# Altium project SL1 Xilinx Spartan-IIE PQ208 Rev1.01.PrjPcb
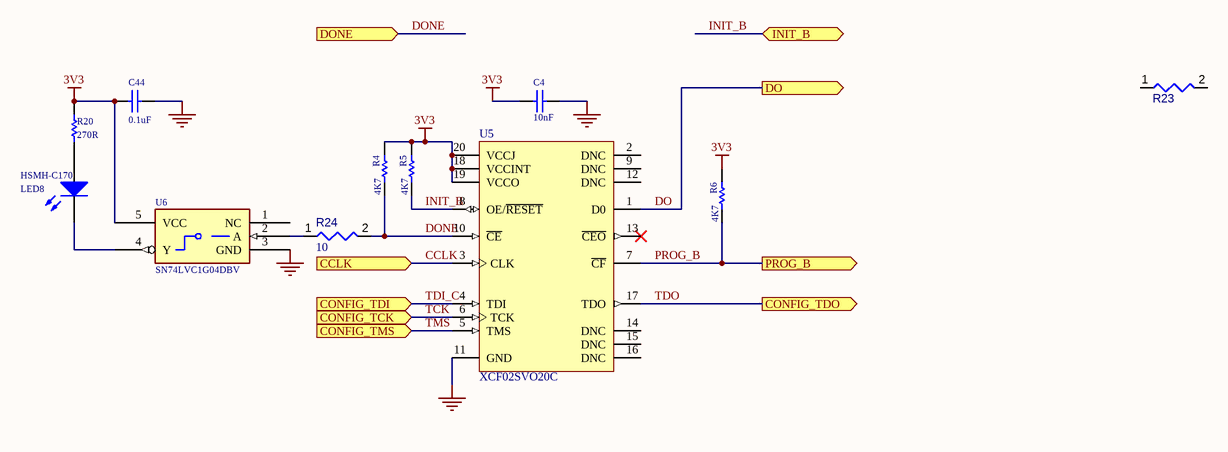
[diagram p0: SL_Config_2E.SchDoc]
2 sheets, 70 parts. Net scope: flat (ports and power ports of the same name join across sheets).
Board file: SL1 Xilinx Spartan-IIE PQ208 Rev1.01.PcbDoc
Sheets:
  SL_Config_2E.SchDoc
  SL_Power.SchDoc

## Sheet SL_Config_2E.SchDoc: FPGA Configuration
size A; Organization: Altium Limited; Address1: L3, 12a Rodborough Rd; Address2: Frenchs Forest; Address3: NSW; Address4: Australia 2086; DocumentNumber: 2; SheetNumber: 2; SheetTotal: 5; Library Name: SpiritLevel_2E.SchLib

### Parts
C4  10nF  [CC1608-0603]
C44  0.1uF  [CC2012-0805]
LED8  HSMH-C170  [SMD _LED]
R4  4K7  [CR2012-0805]
R5  4K7  [CR2012-0805]
R6  4K7  [CR2012-0805]
R20  270R  [CR2012-0805]
R23  Resistors  (value not drawn)
R24  value 10  [RESC1005X40X25ML10T10]  (hidden comment: Resistor 10R +/-5% 0402 63 mW)
U5  XCF02SVO20C  [VO20]
U6  SN74LVC1G04DBV  [SO-G5/P.95]

### Ports
CCLK (in), CONFIG_TCK (in), CONFIG_TDI (in), CONFIG_TDO (out), CONFIG_TMS (in), DO (out), DONE (in), INIT_B (bidir), PROG_B (out)

### Nets
3V3: C4.1 C44.2 R4.1 R5.1 R6.1 R20.2 U5.18(VCCINT) U5.19(VCCO) U5.20(VCCJ) U6.5(VCC)
GND: C4.2 C44.1 U5.11(GND) U6.3(GND)
CCLK: U5.3(CLK) ; port CCLK
DO: U5.1(D0) ; port DO
DONE: R4.2 R24.2 U5.10(~{CE}) ; port DONE
INIT_B: R5.2 U5.8(OE/~{RESET}) ; port INIT_B
PROG_B: R6.2 U5.7(~{CF}) ; port PROG_B
TCK: U5.6(TCK) ; port CONFIG_TCK
TDI_C: U5.4(TDI) ; port CONFIG_TDI
TDO: U5.17(TDO) ; port CONFIG_TDO
TMS: U5.5(TMS) ; port CONFIG_TMS
NetLED8_1: LED8.1(A) R20.1
NetLED8_2: LED8.2(K) U6.4(Y)
NetR24_1: R24.1 U6.2(A)

Not connected (* = marked no-connect by the designer): R23 1 2; U5 2(DNC) 9(DNC) 12(DNC) 13(~{CEO})* 14(DNC) 15(DNC) 16(DNC); U6 1(NC)

### Notes on the sheet
- Title
- Size:
- Date:
- A
- Number:
- Time:
- Revision:
- Sheet
- of
- File:

### Library data of the parts
C4 = CAP: Capacitor; AEMS Code: 2100341
C44 = CAP: Capacitor; Supplier: FARNELL; Supplier Code: 317-287
LED8 = HSMX-C670: Typical RED GaAs SMD LED Agilent make; AEMS Code: 2610081; Revision: July-2002: Re-released for DXP Platform.
R4-R6 = RES: Resistor; AEMS Code: 1200226
R20 = RES: Resistor; AEMS Code: 1200430
R23 = Resistors: Resistor; Component Type: Resistors
R24 = CMP-009-00020-4: Chip Resistor, 10 Ohm, +/- 5%, 0.063 W, -55 to 155 degC, 0402 (1005 Metric); Power: 63mW; Min Operating Temperature: -55°C; Tolerance: 5%; Pins: 2; RoHS Compliant: True; Max Operating Temperature: 155°C; Case/Package: 0402; Mounting Technology: SM
U5 = XCF02SVO20C: XCF00S Series, Platform Flash In-System Programmable Configuration 3.3V PROM, 20-Pin TSOP, 2-Megabit, Commercial Grade; PackageDocument: ver1.0, May-2003; AEMS Code: CHANGED VALUE; DatasheetDocument: ver2.3, May-2004; PackageReference: VO20; Code_JEDEC: MO-153-AC
U6 = SN74AHC1G04DBVR: Manufacturer: TI

## Sheet SL_Power.SchDoc: Power Supply
size B; Organization: Altium Limited; Address1: L3, 12a Rodborough Rd; Address2: Frenchs Forest; Address3: NSW; Address4: Australia 2086; DocumentNumber: 4; SheetNumber: 4; SheetTotal: 5; Library Name: SpiritLevel_2E.SchLib
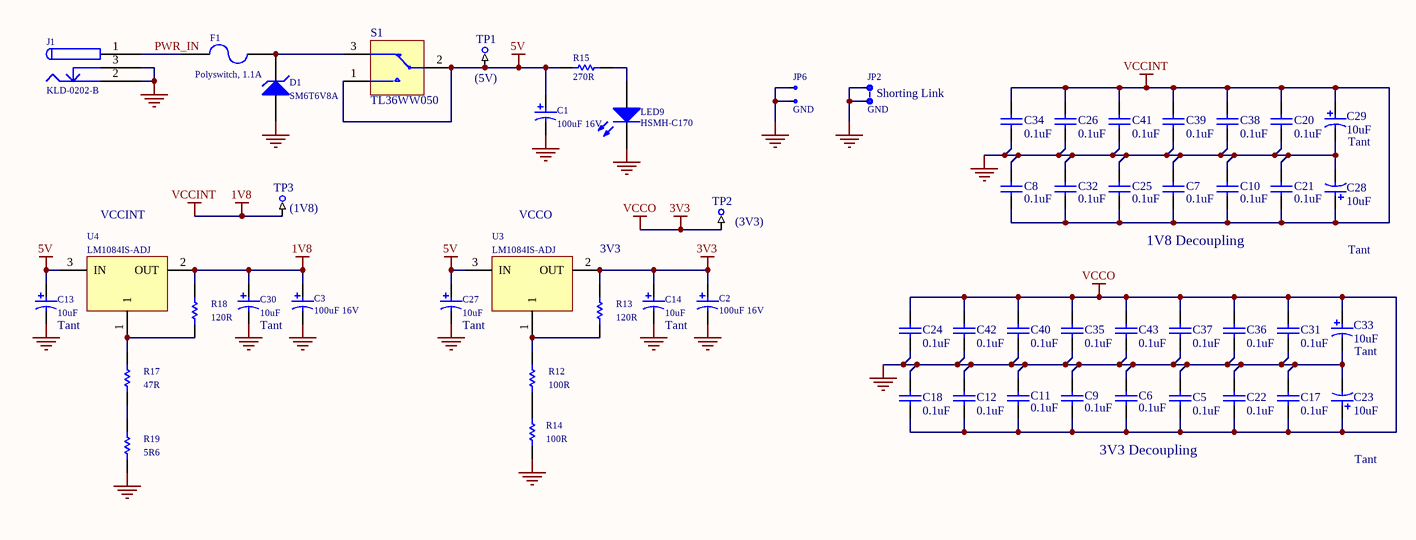
[diagram p1: SL_Power.SchDoc]

### Parts
C1  100uF 16V  [CAPPR2-5X6.8]
C2  100uF 16V  [CAPPR2-5X6.8]
C3  100uF 16V  [CAPPR2-5X6.8]
C5  0.1uF  [CC2012-0805]
C6  0.1uF  [CC2012-0805]
C7  0.1uF  [CC2012-0805]
C8  0.1uF  [CC2012-0805]
C9  0.1uF  [CC2012-0805]
C10  0.1uF  [CC2012-0805]
C11  0.1uF  [CC2012-0805]
C12  0.1uF  [CC2012-0805]
C13  10uF  Capacitor Type: Tant  [MCCT-B]
C14  10uF  Capacitor Type: Tant  [MCCT-B]
C17  0.1uF  [CC2012-0805]
C18  0.1uF  [CC2012-0805]
C20  0.1uF  [CC2012-0805]
C21  0.1uF  [CC2012-0805]
C22  0.1uF  [CC2012-0805]
C23  10uF  Capacitor Type: Tant  [MCCT-B]
C24  0.1uF  [CC2012-0805]
C25  0.1uF  [CC2012-0805]
C26  0.1uF  [CC2012-0805]
C27  10uF  Capacitor Type: Tant  [MCCT-B]
C28  10uF  Capacitor Type: Tant  [MCCT-B]
C29  10uF  Capacitor Type: Tant  [MCCT-B]
C30  10uF  Capacitor Type: Tant  [MCCT-B]
C31  0.1uF  [CC2012-0805]
C32  0.1uF  [CC2012-0805]
C33  10uF  Capacitor Type: Tant  [MCCT-B]
C34  0.1uF  [CC2012-0805]
C35  0.1uF  [CC2012-0805]
C36  0.1uF  [CC2012-0805]
C37  0.1uF  [CC2012-0805]
C38  0.1uF  [CC2012-0805]
C39  0.1uF  [CC2012-0805]
C40  0.1uF  [CC2012-0805]
C41  0.1uF  [CC2012-0805]
C42  0.1uF  [CC2012-0805]
C43  0.1uF  [CC2012-0805]
D1  SM6T6V8A  [DO214]
F1  Polyswitch, 1.1A  [RUE160_0.2]
J1  KLD-0202-B  [KLD-0202]
JP2  GND  [HDR1X2]
JP6  GND  [HDR1X2]
JS1  Shorting Link  (mechanical)
LED9  HSMH-C170  [SMD _LED]
R12  100R  [CC2012-0805]
R13  120R  [CC2012-0805]
R14  100R  [CC2012-0805]
R15  270R  [CR2012-0805]
R17  47R  [CC2012-0805]
R18  120R  [CC2012-0805]
R19  5R6  [CC2012-0805]
S1  TL36WW050  [PCB_SWITCH]
TP1  (5V)  [TP]  (no BOM)
TP2  (3V3)  [TP]  (no BOM)
TP3  (1V8)  [TP]  (no BOM)
U3  LM1084IS-ADJ  [TO-263]
U4  LM1084IS-ADJ  [TO-263]

### Nets
1V8: C3.1 C7.1 C8.1 C10.1 C20.1 C21.1 C25.1 C26.1 C28.1 C29.1 C30.1 C32.1 C34.2 C38.1 C39.1 C41.1 R18.1 TP3.1 U4.2(OUT)  [also labelled VCCINT]
3V3: C2.1 C5.2 C6.1 C9.1 C11.1 C12.1 C14.1 C17.2 C18.2 C22.2 C23.1 C24.2 C31.1 C33.1 C35.1 C36.2 C37.1 C40.1 C42.1 C43.1 R13.1 TP2.1 U3.2(OUT)  [also labelled VCCO]
5V: C1.1 C13.1 C27.1 R15.2 S1.1 S1.2 TP1.1 U3.3(IN) U4.3(IN)
GND: C1.2 C2.2 C3.2 C5.1 C6.2 C7.2 C8.2 C9.2 C10.2 C11.2 C12.2 C13.2 C14.2 C17.1 C18.1 C20.2 C21.2 C22.1 C23.2 C24.1 C25.2 C26.2 C27.2 C28.2 C29.2 C30.2 C31.2 C32.2 C33.2 C34.1 C35.2 C36.1 C37.2 C38.2 C39.2 C40.2 C41.2 C42.2 C43.2 D1.1(A) J1.2 J1.3 JP2.1 JP2.2 JP6.1 JP6.2 LED9.2(K) R14.1 R19.2
PWR_IN: F1.1 J1.1
NetD1_2: D1.2(K) F1.2 S1.3
NetLED9_1: LED9.1(A) R15.1
NetR12_1: R12.1 R13.2 U3.1
NetR12_2: R12.2 R14.2
NetR17_1: R17.1 R18.2 U4.1
NetR17_2: R17.2 R19.1

### Notes on the sheet
- (near U4) VCCINT
- (near U3) VCCO
- 3V3
- 1V8 Decoupling
- 3V3 Decoupling
- Title
- Size:
- Date:
- B
- Number:
- Time:
- Revision:
- Sheet
- of
- File:

### Library data of the parts
C1-C3 = CAP_POLAR_1: Polar Capacitor
C5-C12 C17 C18 C20-C22 C24-C26 C31 C32 C34-C43 = CAP: Capacitor; Supplier: FARNELL; Supplier Code: 317-287
C13 C14 C23 C27-C30 C33 = CAP_POLAR: Polar Capacitor; AEMS Code: 2100110; Supplier: FARNELL; Supplier Code: 967-117
D1 = BZG03C13: Zener Diode, 6.2V, 5W; Manufacturer: Microsemi; Revision: 31-Oct-2003
F1 = Fuse 2: Polyswitch 1.1A, Raychem RUE110; Revision: July-2002: Re-released for DXP Platform.; Supplier: FARNELL; Supplier Code: 608-907
J1 = KLD-0202-B: Low Voltage Power Supply Connector; Manufacturer: Kycon; AEMS Code: 3510211
JP2 JP6 = Jumper, 2-Pin
JS1 = Jumper Socket: Shorting Link, 2.54mm (0.1") Pitch
LED9 = HSMX-C670: as LED8 on sheet SL_Config_2E; Revision: July-2002: Re-released for DXP Platform.
R12 R14 = RES: Resistor; AEMS Code: 1200012JT
R13 R18 = RES: Resistor; AEMS Code: 1200781
R15 = RES: Resistor; AEMS Code: 1200430
R17 = RES: Resistor; AEMS Code: CHANGED VALUE
R19 = RES: Resistor; AEMS Code: 1200069
S1 = PCB_MOUNT_SWITCH: SPDT Subminiature Toggle Switch; Supplier: FARNELL; Supplier Code: 150-559
TP1-TP3 = TestPin
U3 U4 = LM1084IS-ADJ: 5A Low Dropout Possitive Regulators

## Nets that join several sheets
3V3: SL_Config_2E (10 pins), SL_Power (23 pins)
GND: SL_Config_2E (C4.2 C44.1 U5.11 U6.3), SL_Power (49 pins)